# Altium project ESE5160_Co1n1oT.PrjPcb
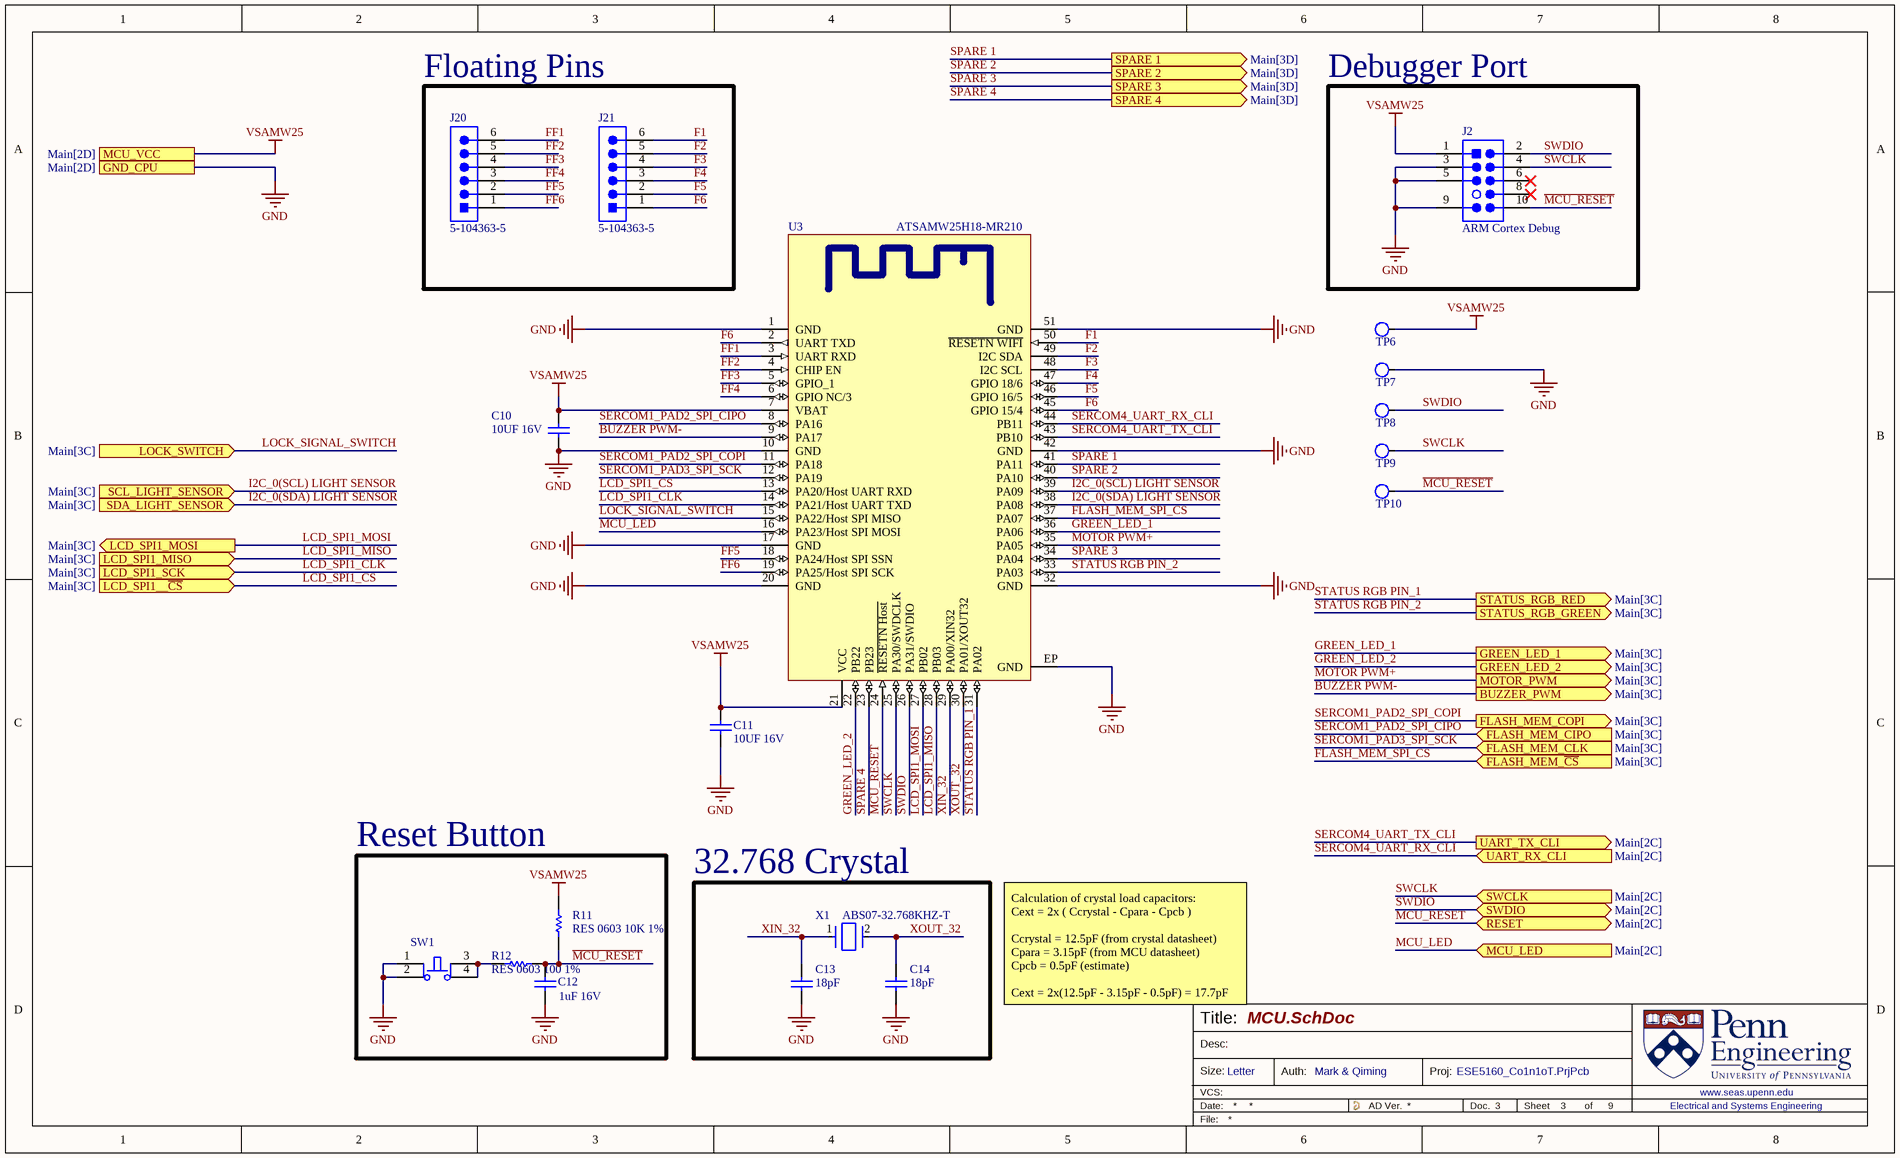
[diagram p0: MCU.SchDoc]
4 sheets, 27 parts. Net scope: strictly hierarchical (ports join the sheet entries above them; power ports are local).
Board file: Co1n1oT.PcbDoc
Sheets:
  MCU.SchDoc
  STATUS_RGB.SchDoc
  BUCK.SchDoc
  358LCD.SchDoc

## Sheet MCU.SchDoc
size Legal; Author: Mark & Qiming; DocumentNumber: 3; SheetNumber: 3; SheetTotal: 9

### Parts
C10  10UF 16V  [0805_CAP_60H]
C11  10UF 16V  [0805_CAP_60H]
C12  1uF 16V  [0603_CAP]
C13  18pF  [0603_CAP]
C14  18pF  [0603_CAP]
J2  ARM Cortex Debug  [FTSH-105-01-F-DV-007-K PLUGIN]
J20  5-104363-5  [5-104363-5-Footprint-1]
J21  5-104363-5  [5-104363-5-Footprint-1]
R11  RES 0603 10K 1%  [0603_RES]
R12  RES 0603 100 1%  [0603_RES]
SW1  PTS810SJK250SMTRLFS  [PTS810SJK250SMTRLFS-Footprint-1]  (value not drawn)
TP6  Testpad  [SMT Testpoint, 50mil]  (value not drawn)  (no BOM)
TP7  Testpad  [SMT Testpoint, 50mil]  (value not drawn)  (no BOM)
TP8  Testpad  [SMT Testpoint, 50mil]  (value not drawn)  (no BOM)
TP9  Testpad  [SMT Testpoint, 50mil]  (value not drawn)  (no BOM)
TP10  Testpad  [SMT Testpoint, 50mil]  (value not drawn)  (no BOM)
U3  ATSAMW25H18-MR210  [ATSAMW25H18-MR210-Footprint-1]
X1  ABS07-32.768KHZ-T  [FP-ABS07-MFG]

### Blocks framed on the sheet
Floating Pins: J20 J21
Debugger Port: J2
Reset Button: C12 R11 R12 SW1
32.768 Crystal: C13 C14 X1

### Ports
BUZZER_PWM (out, see Main[3C]), FLASH_MEM_CIPO (in, see Main[3C]), FLASH_MEM_CLK (in, see Main[3C]), FLASH_MEM_COPI (out, see Main[3C]), FLASH_MEM_~{CS} (in, see Main[3C]), GND_CPU (see Main[2D]), GREEN_LED_1 (out, see Main[3C]), GREEN_LED_2 (out, see Main[3C]), LCD_SPI1__~{CS} (in, see Main[3C]), LCD_SPI1_MISO (in, see Main[3C]), LCD_SPI1_MOSI (out, see Main[3C]), LCD_SPI1_SCK (in, see Main[3C]), LOCK_SWITCH (in, see Main[3C]), MCU_LED (in, see Main[2C]), MCU_VCC (see Main[2D]), MOTOR_PWM (out, see Main[3C]), RESET (bidir, see Main[2C]), SCL_LIGHT_SENSOR (in, see Main[3C]), SDA_LIGHT_SENSOR (in, see Main[3C]), SPARE 1 (out, see Main[3D]), SPARE 2 (out, see Main[3D]), SPARE 3 (out, see Main[3D]), SPARE 4 (out, see Main[3D]), STATUS_RGB_GREEN (out, see Main[3C]), STATUS_RGB_RED (out, see Main[3C]), SWCLK (in, see Main[2C]), SWDIO (bidir, see Main[2C]), UART_RX_CLI (in, see Main[2C]), UART_TX_CLI (out, see Main[2C])

### Nets
GND: C10.1 C11.2 C12.1 C13.1 C14.1 J2.3 J2.5 J2.9 SW1.1 SW1.2 TP7.1 U3.1(GND) U3.10(GND) U3.17(GND) U3.20(GND) U3.32(GND) U3.42(GND) U3.51(GND) U3.EP(GND) ; port GND_CPU
VSAMW25: C10.2 C11.1 J2.1 R11.2 TP6.1 U3.7(VBAT) U3.21(VCC) ; port MCU_VCC
BUZZER PWM-: U3.9(PA17) ; port BUZZER_PWM
F1: J21.6 U3.50(~{RESETN_WIFI})  [project net F1_3]
F2: J21.5 U3.49(I2C_SDA)  [project net F2_3]
F3: J21.4 U3.48(I2C_SCL)  [project net F3_3]
F4: J21.3 U3.47(GPIO_18/6)  [project net F4_3]
F5: J21.2 U3.46(GPIO_16/5)  [project net F5_3]
F6: J21.1 U3.2(UART_TXD) U3.45(GPIO_15/4)  [project net F6_3]
FF1: J20.6 U3.3(UART_RXD)  [project net FF1_3]
FF2: J20.5 U3.4(CHIP_EN)  [project net FF2_3]
FF3: J20.4 U3.5(GPIO_1)  [project net FF3_3]
FF4: J20.3 U3.6(GPIO_NC/3)  [project net FF4_3]
FF5: J20.2 U3.18(PA24/Host_SPI_SSN)  [project net FF5_3]
FF6: J20.1 U3.19(PA25/Host_SPI_SCK)  [project net FF6_3]
FLASH_MEM_SPI_~{CS}: U3.37(PA07) ; port FLASH_MEM_~{CS}
GREEN_LED_1: U3.36(PA06) ; port GREEN_LED_1
GREEN_LED_2: U3.22(PB22) ; port GREEN_LED_2
I2C_0(SCL) LIGHT SENSOR: U3.39(PA09) ; port SCL_LIGHT_SENSOR
I2C_0(SDA) LIGHT SENSOR: U3.38(PA08) ; port SDA_LIGHT_SENSOR
LCD_SPI1_~{CS}: U3.13(PA20/Host_UART_RXD) ; port LCD_SPI1__~{CS}
LCD_SPI1_CLK: U3.14(PA21/Host_UART_TXD) ; port LCD_SPI1_SCK
LCD_SPI1_MISO: U3.28(PB03) ; port LCD_SPI1_MISO
LCD_SPI1_MOSI: U3.27(PB02) ; port LCD_SPI1_MOSI
LOCK_SIGNAL_SWITCH: U3.15(PA22/Host_SPI_MISO) ; port LOCK_SWITCH
~{MCU_RESET}: C12.2 J2.10 R11.1 R12.2 TP10.1 U3.24(~{RESETN_Host})  [project net ~{MCU_RESET}_3]
MCU_LED: U3.16(PA23/Host_SPI_MOSI) ; port MCU_LED
MCU_RESET: port RESET
MOTOR PWM+: U3.35(PA05) ; port MOTOR_PWM
SERCOM1_PAD2_SPI_CIPO: U3.8(PA16) ; port FLASH_MEM_CIPO
SERCOM1_PAD2_SPI_COPI: U3.11(PA18) ; port FLASH_MEM_COPI
SERCOM1_PAD3_SPI_SCK: U3.12(PA19) ; port FLASH_MEM_CLK
SERCOM4_UART_RX_CLI: U3.44(PB11) ; port UART_RX_CLI
SERCOM4_UART_TX_CLI: U3.43(PB10) ; port UART_TX_CLI
SPARE 1: U3.41(PA11) ; port SPARE 1
SPARE 2: U3.40(PA10) ; port SPARE 2
SPARE 3: U3.34(PA04) ; port SPARE 3
SPARE 4: U3.23(PB23) ; port SPARE 4
STATUS RGB PIN_1: U3.31(PA02) ; port STATUS_RGB_RED
STATUS RGB PIN_2: U3.33(PA03) ; port STATUS_RGB_GREEN
SWCLK: J2.4 TP9.1 U3.25(PA30/SWDCLK) ; port SWCLK
SWDIO: J2.2 TP8.1 U3.26(PA31/SWDIO) ; port SWDIO
XIN_32: C13.2 U3.29(PA00/XIN32) X1.1  [project net XIN_32_3]
XOUT_32: C14.2 U3.30(PA01/XOUT32) X1.2  [project net XOUT_32_3]
NetR12_1: R12.1 SW1.3 SW1.4

Not connected (* = marked no-connect by the designer): J2 6* 8*

### Notes on the sheet
- Calculation of crystal load capacitors:
  Cext = 2x ( Ccrystal - Cpara - Cpcb )
  Ccrystal = 12.5pF (from crystal datasheet)
  Cpara = 3.15pF (from MCU datasheet)
  Cpcb = 0.5pF (estimate)
  Cext = 2x(12.5pF - 3.15pF - 0.5pF) = 17.7pF
- Title:
- Desc:
- Size:
- Letter
- Auth:
- Proj:
- Sheet
- of
- www.seas.upenn.edu
- Electrical and Systems Engineering

### Library data of the parts
C10 C11 = CMP-011-000479-1: Capacitor Surface Mount 0805 Footprint 10UF 16V 20% Tolerance Ceramic X7R; Manufacturer: Various; Manufacturer P/N: CAP 0805 10UF 16V 20% X7R; PCB Package: 0805; Description in Visual: Cap SMT 0805 10UF 16V 20% Ceramic X7R; Tolerance: 20%; Type: Ceramic X7R; Mount: SMT; P/N: CAP 0805 10UF 16V 20% X7R; Voltage: 16V; Value: 10UF
C12 = CMP-011-000286-1: Capacitor Surface Mount 0603 Footprint 1UF 16V 10% Tolerance Ceramic X7R; Manufacturer: Various; P/N: CAP 0603 1UF 16V 10% X7R; PCB Package: 0603; Description in Visual: Cap SMT 0603 1UF 16V 10% Ceramic X7R; Manufacturer P/N: CAP 0603 1UF 16V 10% X7R; Tolerance: 10%; Type: Ceramic X7R; Value: 1UF; Mount: SMT; Voltage: 16V
C13 C14 = CMP-011-000283-1: Capacitor Surface Mount 0603 Footprint 18PF 50V 5% Tolerance Ceramic C0G; Manufacturer: Various; Manufacturer P/N: CAP 0603 18PF 50V 5% C0G; Description in Visual: Cap SMT 0603 18PF 50V 5%  Cer C0G; PCB Package: 0603; Voltage: 50V; Type: Ceramic C0G; Tolerance: 5%; Value: 18PF; P/N: CAP 0603 18PF 50V 5% C0G; Mount: SMT
J2 = CMP-002-000013-1: 10 Pin Shrouded Header, 0.050", Key Pin 7; Manufacturer P/N: Various; Manufacturer: Samtech; Gender: Male; Number of Contacts: 10; ComponentLink1URL: http://infocenter.arm.com/help/topic/com.arm.doc.faqs/attached/13634/cortex_debug_connectors.pdf; Description in Visual: 10 Pin Shrouded Header, 0.050", Key Pin 7; P/N: ARM Cortex Debug; Number of Rows: 2; Contact Finish: Gold; ComponentLink1Description: Pinout Reference; ComponentLink2URL: http://suddendocs.samtec.com/catalog_english/ftsh_smt.pdf; Pitch: 0.050"; Orientation: Vertical; ComponentLink2Description: Datasheet for Connector
J20 J21 = CMP-00108-1: Board Connector, 6 Contact(s), 1 Row(s), Male, Straight, 0.1 inch Pitch, Solder Terminal, Locking, Black Insulator, Plug
R11 = CMP-005-002156-3: Resistor Surface Mount, 10K Ohms, 0603 Footprint, 1% Tolerance 0.1W; Manufacturer: Various; PCB Package: 0603; Description in Visual: Res SMT 10K 0603  1%  0.1W; Manufacturer P/N: RES 0603 10K 1%; Tolerance: 1%; Mount: SMT; Value: 10k; JLCPCB Part #: C25804; Power Rating: 0.1W
R12 = CMP-005-002125-2: Resistor Surface Mount, 100 Ohms, 0603 Footprint, 1% Tolerance 0.1W; Manufacturer: Various; Manufacturer P/N: RES 0603 100R 1%; Value: 100; Description in Visual: Res SMT 100 0603  1%  0.1W; PCB Package: 0603; Mount: SMT; Tolerance: 1%; Power Rating: 0.1W
SW1 = CMP-00084-3: Keypad Switch, 1 Switches, SPST, Momentary tactile button, 0.05A, 16VDC, 3.23N, Solder Terminal, Surface Mount-straight; Manufacturer Series: PTS810; Actuator Length: 0.028inch; Electrical Life: 50000Cycles; Contact Resistance: 0.5mR; Solderability: REFLOW; Actuator Travel: 0.1524mm; Actuator Color: White; Actuator Type: Pushbutton; Insulation Resistance: 100MR; Dielectric Withstand Volts: 250VACV; Switch Function: OFF-MOM; Reach SVHC Compliant: Yes; Terminal Finish: Silver; Switch Type: Keypad; Switch Action: MOMENTARY; RoHS Compliant: Yes; JESD-609 Code: e4; Max Operating Temperature: 85°C; Termination: Solder; Min Operating Temperature: -40°C; Mounting Technology: Surface Mount; Circuit: SPST; Type: Tactile
TP6-TP10 = CMP-00049-4: Test Pad/Point (Testpoint, Testpad), for probing
U3 = CMP-00071-2: WiFi 802.11b/g/n Transceiver Module 2.412GHz ~ 2.484GHz Integrated, Trace Surface Mount, Integrated SAMD21 Cortex M0+
X1 = CMP-0447-00001-4: Crystal 32.768kHz ±20ppm (Tol) 12.5pF FUND 70kΩ 2-Pin CSMD T/R; ESR (Equivalent Series Resistance): 70kR; Frequency: 32.768kHz; Radiation Hardening: No; Length: 3.2mm; Max Operating Temperature: 85°C; Number of Pins: 2; Series: ABS07; Min Operating Temperature: -40°C; Frequency Tolerance: 20ppm; Packaging: Tape and Reel; Height: 0.9mm; Width: 1.5mm; Depth: 1.5mm; Load Capacitance: 12.5pF; RoHS Compliant: Yes; Tolerance: 20ppm; Termination: SMD/SMT; Lead Free: Lead Free; Series Resistance: 70kR; REACH SVHC: No SVHC; Case/Package: CSMD; Operating Frequency: 32.768 kHz; Package Quantity: 3000

## Sheet STATUS_RGB.SchDoc
size Legal; Author: Mark & Qiming; DocumentNumber: 4; SheetNumber: 4; SheetTotal: 9
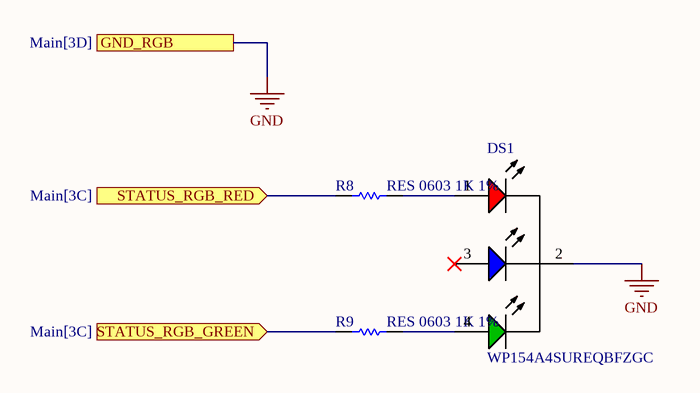
[diagram p1: STATUS_RGB.SchDoc]

### Parts
DS1  WP154A4SUREQBFZGC  [KING-WP154A4SUREQBFZGC_V]
R8  RES 0603 1K 1%  [0603_RES]
R9  RES 0603 1K 1%  [0603_RES]

### Ports
GND_RGB (see Main[3D]), STATUS_RGB_GREEN (in, see Main[3C]), STATUS_RGB_RED (in, see Main[3C])

### Nets
GND: DS1.2(CATHODE) ; port GND_RGB
STATUS_RGB_GREEN: R9.2 ; port STATUS_RGB_GREEN
STATUS_RGB_RED: R8.2 ; port STATUS_RGB_RED
NetDS1_1: DS1.1(RED) R8.1
NetDS1_4: DS1.4(GREEN) R9.1

Not connected (* = marked no-connect by the designer): DS1 3(BLUE)*

### Notes on the sheet
- Title:
- Desc:
- Size:
- Letter
- Auth:
- Proj:
- Sheet
- of
- www.seas.upenn.edu
- Electrical and Systems Engineering

### Library data of the parts
DS1 = CMP-2000-07415-1: Full Color LED Lamp, Dominant Wavelength RGB 630 / 525 / 465 nm, -40 to 85 degC, 4-Pin THD, RoHS; Manufacturer: Kingbright; Viewing Angle: 50°; Wavelength - Dominant: 630nm,525nm,465nm; Online Catalog: 5mm,T-13/4(RGB)RoundwithDomedTopLEDLamp; Millicandela Rating: 1300mcdRed,1700mcdGreen,900mcdBlue; Other Names: 754-1615 / WP154A4SUREQBFZGC-ND; Current - Test: 20mA; Wavelength - Peak: 645nm,515nm,460nm; Color: Red,Green,Blue(RGB); Voltage - Forward (Vf) (Typ): 1.9VRed,3.3VGreen,3.3VBlue; Lens Type: Clear; 3D Model: WP154A4SUREQBFZGW.sldprt / WP154A4SUREQBFZGW.pro / WP154A4SUREQBFZGW.igs / WP154A4SUREQBFZGW.stp; Lens Style/Size: RoundwithDomedTop,5mm,T-13/4; Packaging: Bulk; Datasheet URL: https://www.kingbrightusa.com/images/catalog/spec/WP154A4SUREQBFZGC.pdf; Family: LEDIndication-Discrete; Datasheet Version: Rev. 5A, 08/2014; Category: Optoelectronics; Manufacturer URL: http://www.kingbright.com/; Height: 8.60mm; Mounting Type: ThroughHole; Package Reference: WP154A4SUREQBFZGC; Mounting Technology: ThroughHole; Package Description: 4-Pin Through Hole LED, Dia 5.9 mm, Pitch 1.27 mm; Standard Package: 500; Package / Case: Radial-4Leads; ComponentLink1Description: New link; ComponentLink1URL: *
R8 R9 = CMP-005-002503-3: Resistor Surface Mount, 1K Ohms, 0603 Footprint, 1% Tolerance 0.1W; Manufacturer: Various; PCB Package: 0603; Description in Visual: Res SMT 1K 0603  1%  0.1W; Tolerance: 1%; Value: 1k; Mount: SMT; Power Rating: 0.1W; Manufacturer P/N: RES 0603 1K 1%; JLCPCB Part #: C21190

## Sheet BUCK.SchDoc
size Legal; Author: Mark & Qiming; DocumentNumber: 8; SheetNumber: 7; SheetTotal: 9
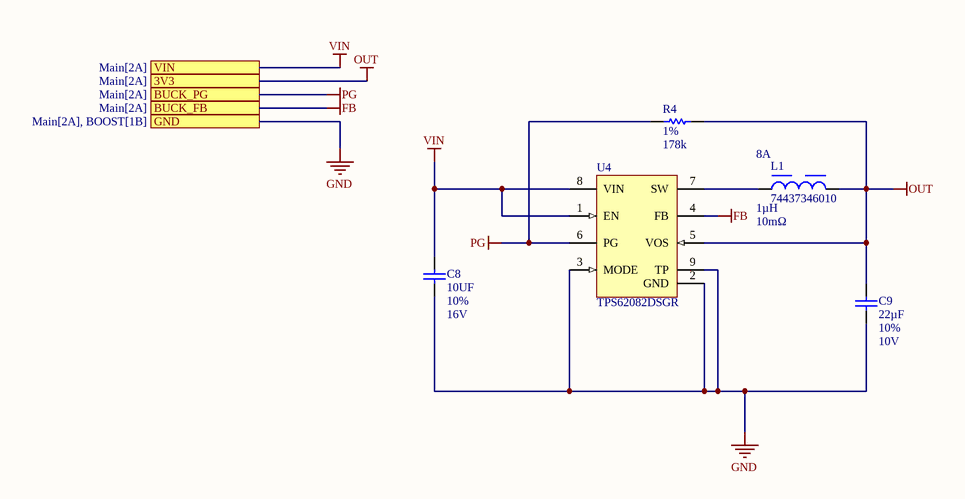
[diagram p2: BUCK.SchDoc]

### Parts
C8  value 10UF  Tolerance: 10%  Voltage: 16V  [1206_CAP]  (hidden comment: CAP 1206 10UF 16V 10% X7R)
C9  value 22µF  Tolerance: 10%  Voltage: 10V  [1206_CAP_75H]  (hidden comment: CAP 1206 22UF 10V 10% X7R)
L1  74437346010  Series Resistance: 10mΩ  Inductance: 1µH  Current Rating: 8A  [WE-LHMI_7030]
R4  value 178k  Tolerance: 1%  [0603_RES]  (hidden comment: RES 0603 178K 1%)
U4  TPS62082DSGR  [DSG0008A_V]

### Ports
3V3 (see Main[2A]), BUCK_FB (see Main[2A]), BUCK_PG (see Main[2A]), GND (see Main[2A], BOOST[1B]), VIN (see Main[2A])

### Nets
FB: U4.4(FB) ; port BUCK_FB
GND: C8.1 C9.1 U4.2(GND) U4.3(MODE) U4.9(TP) ; port GND
OUT: C9.2 L1.2 R4.1 U4.5(VOS) ; port 3V3
PG: R4.2 U4.6(PG) ; port BUCK_PG
VIN: C8.2 U4.1(EN) U4.8(VIN) ; port VIN
NetL1_1: L1.1 U4.7(SW)

### Notes on the sheet
- Title:
- Desc:
- Size:
- Letter
- Auth:
- Proj:
- Sheet
- of
- www.seas.upenn.edu
- Electrical and Systems Engineering

### Library data of the parts
C8 = CMP-011-000639-1: Capacitor Surface Mount 1206 Footprint 10UF 16V 10% Tolerance Ceramic X7R; Manufacturer: Various; PCB Package: 1206; Description in Visual: Cap SMT 1206 10UF 16V 10%  Cer X7R; Type: Ceramic X7R; Mount: SMT; P/N: CAP 1206 10UF 16V 10% X7R; Manufacturer P/N: CAP 1206 10UF 16V 10% X7R
C9 = CMP-011-000660-3: Capacitor Surface Mount 1206 Footprint 22UF 10V 10% Tolerance Ceramic X7R; Manufacturer: Various; PCB Package: 1206; Description in Visual: Cap SMT 1206 22UF 10V 10%  Cer X7R; Manufacturer P/N: CAP 1206 22UF 10V 10% X7R; RoHS: Yes; P/N: CAP 1206 22UF 10V 10% X7R; Case/Package: 1206; JLCPCB Part #: C5672; Mount: SMT; Type: Ceramic X7R; Capacitor Type: Ceramic
L1 = CMP-1353-00047-3: NexarPartId: 22866635; Shielding: Shielded; Core Material: Composite, Ferrite; DC Resistance (DCR): 8.3mΩ; Frequency: 54MHz; Inductance Tolerance: 20%; Test Frequency: 100kHz; Saturation Current: 14.7A; Length: 7.3mm; Depth: 6.6mm; Max Operating Temperature: 125°C; Min Operating Temperature: -40°C; Packaging: Tape & Reel (TR); Mount: Surface Mount; Self Resonant Frequency: 54MHz; REACH SVHC: Unknown; RMS Current (Irms): 8A; RoHS: Compliant; Height: 2.8mm; Ambient Temperature Range Low: -40°C; Tolerance: 20%; Width: 6.6mm; Composition: Wirewound; Height - Seated (Max): 3.0988mm; Case/Package: Nonstandard; Ambient Temperature Range High: 85°C; Max DC Current: 8A; Termination: SMD/SMT
R4 = CMP-005-002436-2: Resistor Surface Mount, 178K Ohms, 0603 Footprint, 1% Tolerance 0.1W; Manufacturer: Various; PCB Package: 0603; Description in Visual: Res SMT 178K 0603  1%  0.1W; Mount: SMT; Manufacturer P/N: RES 0603 178K 1%; Power Rating: 0.1W
U4 = CMP-0323-00344-3: Buck Step Down Regulator with 2.3 to 6 V Input and 3.3 V Output, -40 to 85 degC, 8-Pin WSON (DSG), Green (RoHS & no Sb/Br); Manufacturer: Texas Instruments; Switch Current Limit(Typ)(A): 2.4; Vin(Min)(V): 2.3; Iq(Typ)(mA): 0.006; Regulated Outputs(#): 1; Vout(Max)(V): 3.3; Duty Cycle(Max)(%): 100; Iout(Max)(A): 1.2; SubFamily: Step-Down Regulator; Rating: Catalog; Vin(Max)(V): 6; ComponentLink1Description: Datasheet; ComponentLink3Description: URL Link1; ComponentLink2URL: http://www.ti.com/litv/pdf/mpds308a; DatasheetVersion: SLVSAE8B; PackageVersion: revB, Oct-2010; Eco-Plan: Green (RoHS & no Sb/Br); ComponentLink2Description: Package Specification; PackageReference: DSG0008A; Code_JEDEC: MO-229; Topology: Buck; PartNumber: TPS62082DSGR; PackageDescription: 8-Pin Plastic Small Outline No-Lead, 2 x 2 x 0.8 mm Body, 0.5 mm Pitch, Exposed Pad; ComponentLink1URL: http://www.ti.com/general/docs/lit/getliterature.tsp?genericPartNumber=TPS62082&fileType=pdf; ComponentLink3URL: Samples URL:http://www.ti.com/product/tps62082#samples; Vout(Min)(V): 3.3; Mounting Technology: Surface Mount

## Sheet 358LCD.SchDoc
size Legal; Author: Mark & Qiming; DocumentNumber: 10; SheetNumber: 9; SheetTotal: 9
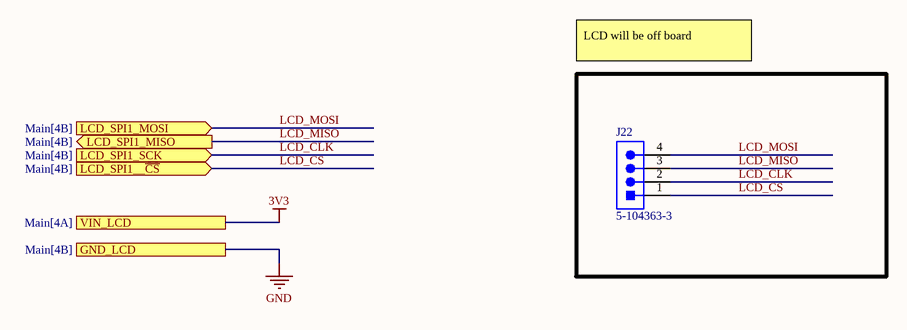
[diagram p3: 358LCD.SchDoc]

### Parts
J22  5-104363-3  [5-104363-3-Footprint-1]

### Ports
GND_LCD (see Main[4B]), LCD_SPI1__~{CS} (in, see Main[4B]), LCD_SPI1_MISO (out, see Main[4B]), LCD_SPI1_MOSI (in, see Main[4B]), LCD_SPI1_SCK (in, see Main[4B]), VIN_LCD (see Main[4A])

### Nets
3V3: port VIN_LCD
GND: port GND_LCD
LCD_~{CS}: J22.1 ; port LCD_SPI1__~{CS}
LCD_CLK: J22.2 ; port LCD_SPI1_SCK
LCD_MISO: J22.3 ; port LCD_SPI1_MISO
LCD_MOSI: J22.4 ; port LCD_SPI1_MOSI

### Notes on the sheet
- LCD will be off board
- Title:
- Desc:
- Size:
- Letter
- Auth:
- Proj:
- Sheet
- of
- www.seas.upenn.edu
- Electrical and Systems Engineering

### Library data of the parts
J22 = CMP-00105-2: Board Connector, 4 Contact(s), 1 Row(s), Male, Straight, 0.1 inch Pitch, Solder Terminal, Locking, Black Insulator, Plug

## Assembly variants
Build_Alt: not fitted DS1 FD1 FD2 FD3 J4 J15 J16 J17 J18 J19 J20 J21 J22 LS1 Q2 TP1 TP2 TP3 TP4 TP5 TP6 TP7 TP8 TP9 TP10 TP11 TP12 TP13 TP14 TP15 TP16